# Altium project ESP32-HomeHub.PrjPcb
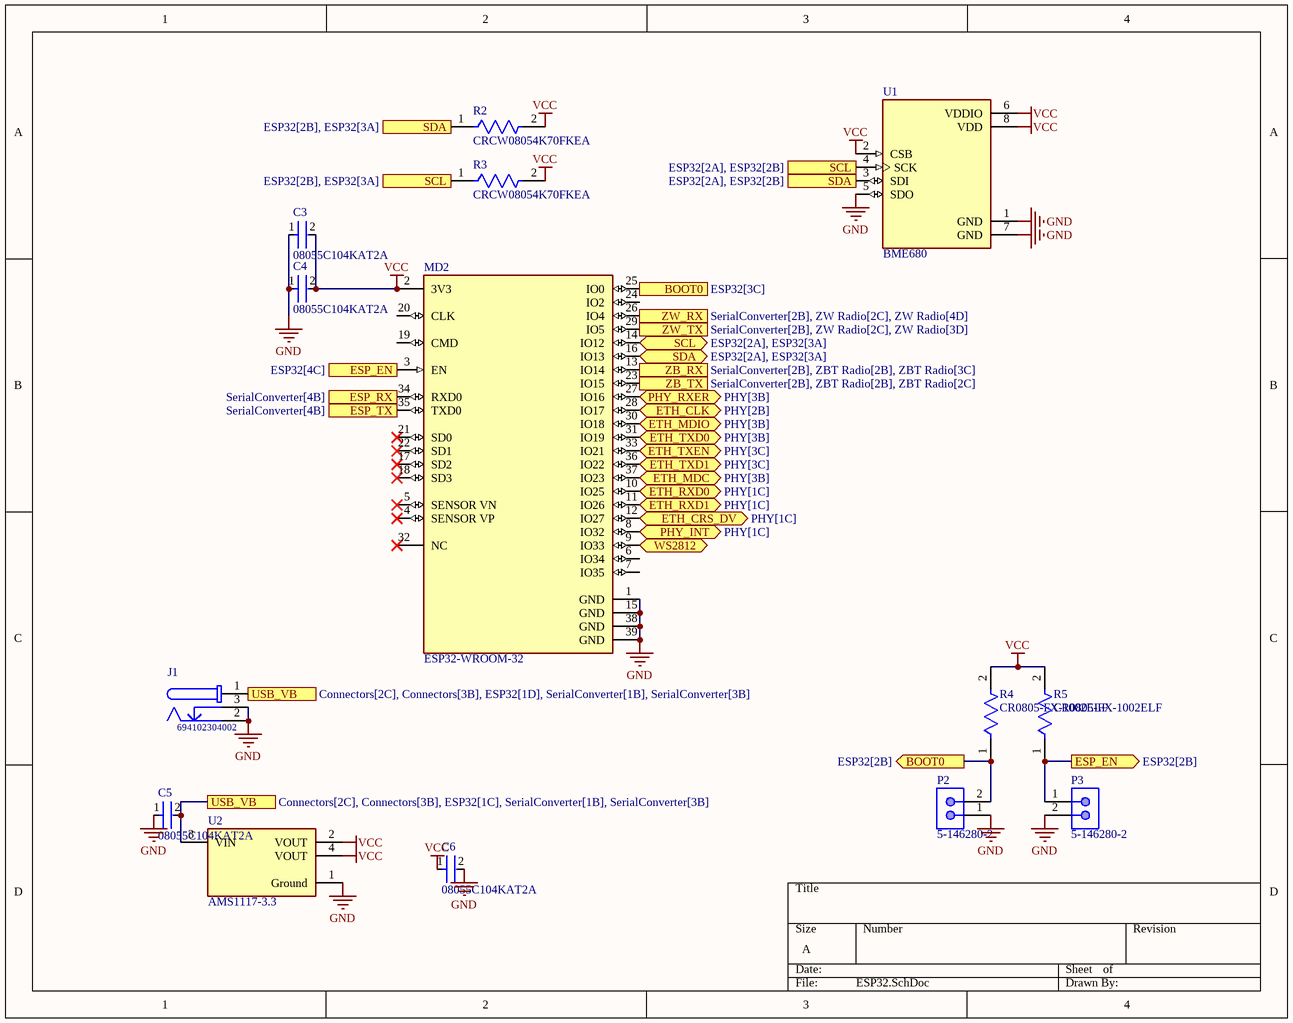
[diagram p0: ESP32.SchDoc]
5 sheets, 46 parts. Net scope: flat (ports and power ports of the same name join across sheets).
Board file: PCB1.PcbDoc
Sheets:
  ESP32.SchDoc
  SerialConverter.SchDoc
  Connectors.SchDoc
  PHY.SchDoc
  ZW Radio.SchDoc

## Sheet ESP32.SchDoc
size A; SheetNumber: 2; SheetTotal: 6

### Parts
C3  08055C104KAT2A  [FP-0805-L_2_01_0_2-W_1_25-IPC_C]
C4  08055C104KAT2A  [FP-0805-L_2_01_0_2-W_1_25-IPC_C]
C5  08055C104KAT2A  [FP-0805-L_2_01_0_2-W_1_25-IPC_C]
C6  08055C104KAT2A  [FP-0805-L_2_01_0_2-W_1_25-IPC_C]
J1  694102304002  [694102304002]
MD2  ESP32-WROOM-32  [FP-ESP32-WROOM-32-MFG]
P2  5-146280-2  [TECO-5-146280-2_V]
P3  5-146280-2  [TECO-5-146280-2_V]
R2  CRCW08054K70FKEA  [FP-CRCW0805-e3-IPC_B]
R3  CRCW08054K70FKEA  [FP-CRCW0805-e3-IPC_B]
R4  CR0805-FX-1002ELF  [FP-CR0805-IPC_A]
R5  CR0805-FX-1002ELF  [FP-CR0805-IPC_A]
U1  BME680  [PSON80P300X300X100-8N]
U2  AMS1117-3.3  [FP-AMS1117-IPC_C]

### Ports
BOOT0 (in, see ESP32[3C]), BOOT0 (out, see ESP32[2B]), ESP_EN (in, see ESP32[4C]), ESP_EN (out, see ESP32[2B]), ESP_RX (in, see SerialConverter[4B]), ESP_TX (out, see SerialConverter[4B]), ETH_CLK (bidir, see PHY[2B]), ETH_CRS_DV (bidir, see PHY[1C]), ETH_MDC (bidir, see PHY[3B]), ETH_MDIO (bidir, see PHY[3B]), ETH_RXD0 (bidir, see PHY[1C]), ETH_RXD1 (bidir, see PHY[1C]), ETH_TXD0 (bidir, see PHY[3B]), ETH_TXD1 (bidir, see PHY[3C]), ETH_TXEN (bidir, see PHY[3C]), PHY_INT (bidir, see PHY[1C]), PHY_RXER (bidir, see PHY[3B]), SCL (bidir, see ESP32[2A], ESP32[3A]), SCL (see ESP32[2A], ESP32[2B]), SCL (see ESP32[2B], ESP32[3A]), SDA (bidir, see ESP32[2A], ESP32[3A]), SDA (see ESP32[2A], ESP32[2B]), SDA (see ESP32[2B], ESP32[3A]), USB_VB (see Connectors[2C], Connectors[3B], ESP32[1C], SerialConverter[1B], SerialConverter[3B]), USB_VB (see Connectors[2C], Connectors[3B], ESP32[1D], SerialConverter[1B], SerialConverter[3B]), WS2812 (bidir), ZB_RX (out, see SerialConverter[2B], ZBT Radio[2B], ZBT Radio[3C]), ZB_TX (in, see SerialConverter[2B], ZBT Radio[2B], ZBT Radio[2C]), ZW_RX (out, see SerialConverter[2B], ZW Radio[2C], ZW Radio[4D]), ZW_TX (in, see SerialConverter[2B], ZW Radio[2C], ZW Radio[3D])

### Nets
GND: C3.1 C4.1 C5.1 C6.2 J1.2 J1.3 MD2.1(GND) MD2.15(GND) MD2.38(GND) MD2.39(GND) P2.1 P3.2 U1.1(GND) U1.5(SDO) U1.7(GND) U2.1(Ground)
VCC: C3.2 C4.2 C6.1 MD2.2(3V3) R2.2 R3.2 R4.2 R5.2 U1.2(CSB) U1.6(VDDIO) U1.8(VDD) U2.2(VOUT) U2.4(VOUT)
BOOT0: MD2.25(IO0) P2.2 R4.1 ; port BOOT0
ESP_EN: MD2.3(EN) P3.1 R5.1 ; port ESP_EN
ESP_RX: MD2.34(RXD0) ; port ESP_RX
ESP_TX: MD2.35(TXD0) ; port ESP_TX
ETH_CLK: MD2.28(IO17) ; port ETH_CLK
ETH_CRS_DV: MD2.12(IO27) ; port ETH_CRS_DV
ETH_MDC: MD2.37(IO23) ; port ETH_MDC
ETH_MDIO: MD2.30(IO18) ; port ETH_MDIO
ETH_RXD0: MD2.10(IO25) ; port ETH_RXD0
ETH_RXD1: MD2.11(IO26) ; port ETH_RXD1
ETH_TXD0: MD2.31(IO19) ; port ETH_TXD0
ETH_TXD1: MD2.36(IO22) ; port ETH_TXD1
ETH_TXEN: MD2.33(IO21) ; port ETH_TXEN
PHY_INT: MD2.8(IO32) ; port PHY_INT
PHY_RXER: MD2.27(IO16) ; port PHY_RXER
SCL: MD2.14(IO12) R3.1 U1.4(SCK) ; port SCL
SDA: MD2.16(IO13) R2.1 U1.3(SDI) ; port SDA
USB_VB: C5.2 J1.1 U2.3(VIN) ; port USB_VB
WS2812: MD2.9(IO33) ; port WS2812
ZB_RX: MD2.13(IO14) ; port ZB_RX
ZB_TX: MD2.23(IO15) ; port ZB_TX
ZW_RX: MD2.26(IO4) ; port ZW_RX
ZW_TX: MD2.29(IO5) ; port ZW_TX

Not connected (* = marked no-connect by the designer): MD2 4(SENSOR_VP)* 5(SENSOR_VN)* 6(IO34) 7(IO35) 17(SD2)* 18(SD3)* 19(CMD) 20(CLK) 21(SD0)* 22(SD1)* 24(IO2) 32(NC)*

### Library data of the parts
C3-C6 = CMP-2000-05016-2: General Purpose Ceramic Capacitor, 0805, 100nF, 10%, X7R, 0.15, 50V; Dissipation Factor: 2.5%; Insulation Resistance: 100GR; Voltage Rating (DC): 50V; Package Quantity: 4000; Tolerance: 10%; Voltage Rating: 50V; Dielectric: X7R; Case/Package: 0805; Lead Free: Lead Free; Dielectric Material: Ceramic; Thickness: 0.037inch; Weight: 0.001411oz; Max Operating Temperature: 125°C; REACH SVHC: No SVHC; Mount: Surface Mount; RoHS Compliant: Yes; Depth: 1.25mm; Height: 0.5mm; Case Code (Metric): 2012; Length: 2mm; Termination: Standard; Case Code (Imperial): 0805; Number of Pins: 2; Voltage: 50V; Radiation Hardening: No; Min Operating Temperature: -55°C; Capacitance: 100nF; Width: 1.2mm; Series: MLCC X7R; Packaging: Cut Tape
J1 = CMP-1502-00184-1: DC Power Jack Connector Low Profile WR-DC, Male, Right Angled, THT, 2 A, 20 V; Manufacturer: Wurth Elektronik; Plug Outer Diameter: 3.5mm; Opening Diameter: 3.8mm; Plug Inner Diameter: 1.05mm; Rated Current: 2A; Working Voltage: 20V; Datasheet URL: http://katalog.we-online.de/em/datasheet/6941xx304002.pdf; Manufacturer URL: http://www.we-online.de; Publisher: WurthElektronik; Part Number: 694102304002; Package Reference: 694102304002; Packaging: Tray; Mounting Technology: THT; Operating Temperature: -40to85degC; Orientation: RightAngled; Gender: Male
MD2 = CMP-194065-000008-1: RX TXRX MOD WIFI SURFACE MOUNT; Frequency: 2.5GHz; Sensitivity: -98dBm; Operating Supply Voltage: 3.6V; Data Rate: 150Mbps; Weight: 0.088185oz; Package Quantity: 550; Min Operating Temperature: -40°C; Mount: Surface Mount; Max Operating Temperature: 85°C; Packaging: Cut Tape; Case/Package: SMD/SMT
P2 P3 = CMP-2000-07492-1: Male Header, Pitch 2.54 mm, 1 x 2 Position, Height 8.21 mm, Tail Length 3.05 mm, -65 to 105 degC, RoHS, Bulk; Manufacturer: TE Connectivity; Mating Connector Lock: No(Without); Number of Positions: 2; Pitch: 2.54mm; PCB Mounting Orientation: Vertical; Keyed: No; Case\/Package: 100; Mating Post Length: 0.23inch; High Temperature Housing: Yes; Max Current Rating: 5A; PCB Thickness: 0.063inch; PCB Mount Retention: Without; Approvals: CSA; Current Rating: 3A; Radiation Hardening: No; Length: 4.67mm; Contact Mating Length: 0.23inch; Connector Type: Header; Number of Rows: 1; Termination Post Length: 0.12inch; Board Standoff: No(Without); Max Operating Temperature: 105degC; Contact Shape: Square; Selectively Loaded: No(Without); Gasket: No(Without); Number of Contacts: 2; Contact Gender: Male; Mating Alignment: No(Without); Manufacturer URL: http://www.te.com/; Datasheet URL: http://www.te.com/commerce/DocumentDelivery/DDEController?Action=showdoc&DocId=Customer+Drawing%7F146280%7FH1%7Fpdf%7FEnglish%7FENG_CD_146280_H1.pdf%7F5-146280-2; Mount: ThroughHole; Orientation: Straight; Packaging: Carton; Package Reference: 5-146280-2; Package Quantity: 500; Stabilizers: No(Without); Row Spacing: 2.54mm; Contact Material: CopperAlloy; Panel Mount Retention: No(Without); Datasheet Version: Rev. H1, 08/2016; Housing Colour: Black; Colour: Black; Package Description: Male Header, Pitch 2.54 mm, 1 x 2 Position, Height 8.21 mm, Tail Length 3.05 mm; Contact Plating: Matte; Housing Material: Polymer; Contact Protection: No(Without); Min Operating Temperature: -65degC; Mounting Technology: ThroughHole; Flammability Rating: UL94V-0; RoHSCompliant: true; Termination: ThroughHole; Depth: 2.34mm; High Speed Serial Data Connector: No
R2 R3 = CMP-2100-03615-2: RES Thick Film, 4.7kΩ, 1%, 0.125W, 100ppm/°C, 0805; Max Power Dissipation: 125mW; Resistance: 4.7kR; Voltage Rating: 150V; Termination: SMD/SMT; Weight: 0.000194oz; Case/Package: 0805; Number of Terminations: 2; Min Operating Temperature: -55°C; Case Code (Metric): 2012; Package Quantity: 10; Depth: 1.25mm; Military Standard: Not; Composition: Thick Film; Radiation Hardening: No; Contact Plating: Tin; Height: 0.45mm; Power Rating: 125mW; Features: Automotive AEC-Q200; Tolerance: 1%; Packaging: Tape and Reel; Max Operating Temperature: 155°C; Length: 2mm; Case Code (Imperial): 0805; Voltage Rating (DC): 150V; Width: 1.25mm; Temperature Coefficient: 100ppm/°C; Lead Free: Lead Free
R4 R5 = CMP-07231-003204-1: Thick Film Chip Resistors 0805 10kΩ 0.125W 1% 100ppm/°C; Max Power Dissipation: 125mW; Voltage Rating: 150V; Voltage Rating (DC): 100V; Resistance: 10kR; Height: 0.5mm; Tolerance: 1%; Max Operating Temperature: 155°C; Thickness: 508um; Radiation Hardening: No; Packaging: Tape and Reel; Depth: 1.25mm; Contact Plating: Tin; Package Quantity: 1; Case Code (Metric): 2012; REACH SVHC: No SVHC; Min Operating Temperature: -55°C; Power Rating: 125mW; Mount: Surface Mount; Length: 2mm; Case Code (Imperial): 0805; Width: 1.25mm; Temperature Coefficient: 100ppm/°C; Termination: SMD/SMT; Composition: Thick Film; Features: Moisture Resistant; Case/Package: 0805; Number of Terminations: 2
U1 = BME680: Integrated Environmental Unit; MF: {'manufacturer': u'Bosch Sensortec'}; Package: None; Price: None; Value: *; MP: BME680; Availability: Unavailable
U2 = CMP-209535-000001-1: LDO Voltage Regulators 1A, 3.3V; Manufacturer: Advanced Monolithic Systems; Dropout Voltage: 1.1V; Output Type: Fixed; Nominal Supply Current: 5mA; Max Power Dissipation: 1.2W; Max Supply Voltage: 15V; Number Of Outputs: 1; Standoff Height: 0.64mm; Max Junction Temp: +125°C; Height: 1.8mm; Package: AMS1117; Device Class L2: Power Management ICs; ComponentLink2Description: Datasheet; ComponentLink2URL: http://www.advanced-monolithic.com/pdf/ds1117.pdf; Category: IC; RoHS: TRUE; Automotive: No; Device Class L1: Integrated Circuits (ICs); Output Current: 1A; Device Class L3: Voltage Regulators - Linear; Temperature: -40°C to +125°C; Output Voltage: 3.3V; Manufacturer Part Number: AMS1117-3.3; Temperature Range Low: -40°C; Octopart: https://octopart.com/ams1117-3.3-advanced+monolithic+systems-25899300; Lead Free: Yes; Ipc Land Pattern Name: SOT229P700X180-4; Temperature Range High: +125°C

## Sheet SerialConverter.SchDoc
size A; SheetNumber: 3; SheetTotal: 6
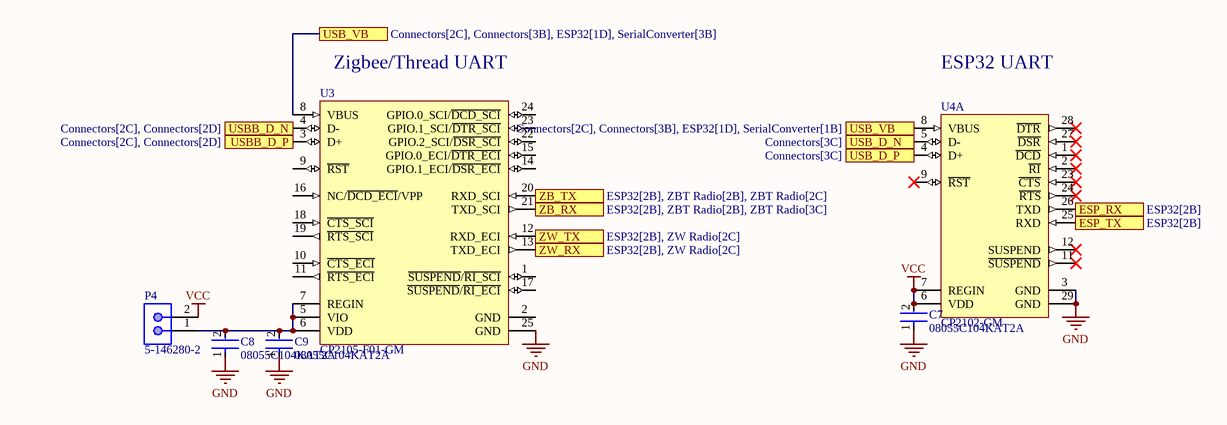
[diagram p1: SerialConverter.SchDoc]

### Parts
C7  08055C104KAT2A  [FP-0805-L_2_01_0_2-W_1_25-IPC_C]
C8  08055C104KAT2A  [FP-0805-L_2_01_0_2-W_1_25-IPC_C]
C9  08055C104KAT2A  [FP-0805-L_2_01_0_2-W_1_25-IPC_C]
P4  5-146280-2  [TECO-5-146280-2_V]
U3  CP2105-F01-GM  [SLAB-QFN-24-2675x2675TP_N]
U4  CP2102-GM  [SLAB-QFN-28-3125x3125TP_N]  (part A of 2)

### Ports
ESP_RX (out, see ESP32[2B]), ESP_TX (in, see ESP32[2B]), USB_D_N (see Connectors[3C]), USB_D_P (see Connectors[3C]), USB_VB (see Connectors[2C], Connectors[3B], ESP32[1D], SerialConverter[1B]), USB_VB (see Connectors[2C], Connectors[3B], ESP32[1D], SerialConverter[3B]), USBB_D_N (see Connectors[2C], Connectors[2D]), USBB_D_P (see Connectors[2C], Connectors[2D]), ZB_RX (out, see ESP32[2B], ZBT Radio[2B], ZBT Radio[3C]), ZB_TX (in, see ESP32[2B], ZBT Radio[2B], ZBT Radio[2C]), ZW_RX (out, see ESP32[2B], ZW Radio[2C]), ZW_TX (in, see ESP32[2B], ZW Radio[2C])

### Nets
GND: C7.1 C8.1 C9.1 U3.25(GND) U4.3(GND) U4.29(GND)
VCC: C7.2 P4.2 U4.6(VDD) U4.7(REGIN)
ESP_RX: U4.26(TXD) ; port ESP_RX
ESP_TX: U4.25(RXD) ; port ESP_TX
USB_D_N: U4.5(D-) ; port USB_D_N
USB_D_P: U4.4(D+) ; port USB_D_P
USB_VB: U3.8(VBUS) U4.8(VBUS) ; port USB_VB
USBB_D_N: U3.4(D-) ; port USBB_D_N
USBB_D_P: U3.3(D+) ; port USBB_D_P
ZB_RX: U3.21(TXD_SCI) ; port ZB_RX
ZB_TX: U3.20(RXD_SCI) ; port ZB_TX
ZW_RX: U3.13(TXD_ECI) ; port ZW_RX
ZW_TX: U3.12(RXD_ECI) ; port ZW_TX
NetC8_2: C8.2 C9.2 P4.1 U3.5(VIO) U3.6(VDD) U3.7(REGIN)

Not connected (* = marked no-connect by the designer): U3 1(~{SUSPEND}/~{RI_SCI}) 2(GND) 9(~{RST}) 10(~{CTS_ECI}) 11(~{RTS_ECI}) 14(GPIO.1_ECI/~{DSR_ECI}) 15(GPIO.0_ECI/~{DTR_ECI}) 16(NC/~{DCD_ECI}/VPP) 17(~{SUSPEND}/~{RI_ECI}) 18(~{CTS_SCI}) 19(~{RTS_SCI}) 22(GPIO.2_SCI/~{DSR_SCI}) 23(GPIO.1_SCI/~{DTR_SCI}) 24(GPIO.0_SCI/~{DCD_SCI}); U4 1(~{DCD})* 2(~{RI})* 9(~{RST})* 11(~{SUSPEND})* 12(SUSPEND)* 23(~{CTS})* 24(~{RTS})* 27(~{DSR})* 28(~{DTR})*

### Notes on the sheet
- (near U3) Zigbee/Thread UART
- ESP32 UART

### Library data of the parts
C7-C9 = CMP-2000-05016-2: as C3 on sheet ESP32; Voltage Rating (DC): 50V; Package Quantity: 4000; Tolerance: 10%; Voltage Rating: 50V; Dielectric: X7R; Case/Package: 0805; Lead Free: Lead Free; Dielectric Material: Ceramic; Thickness: 0.037inch; Weight: 0.001411oz; Max Operating Temperature: 125°C; REACH SVHC: No SVHC; Mount: Surface Mount; RoHS Compliant: Yes; Depth: 1.25mm; Height: 0.5mm; Case Code (Metric): 2012; Length: 2mm; Termination: Standard; Case Code (Imperial): 0805; Number of Pins: 2; Voltage: 50V; Radiation Hardening: No; Min Operating Temperature: -55°C; Capacitance: 100nF; Width: 1.2mm; Series: MLCC X7R; Packaging: Cut Tape
P4 = CMP-2000-07492-1: as P2 on sheet ESP32; Radiation Hardening: No; Length: 4.67mm; Contact Mating Length: 0.23inch; Connector Type: Header; Number of Rows: 1; Termination Post Length: 0.12inch; Board Standoff: No(Without); Max Operating Temperature: 105degC; Contact Shape: Square; Selectively Loaded: No(Without); Gasket: No(Without); Number of Contacts: 2; Contact Gender: Male; Mating Alignment: No(Without); Manufacturer URL: http://www.te.com/; Datasheet URL: http://www.te.com/commerce/DocumentDelivery/DDEController?Action=showdoc&DocId=Customer+Drawing%7F146280%7FH1%7Fpdf%7FEnglish%7FENG_CD_146280_H1.pdf%7F5-146280-2; Mount: ThroughHole; Orientation: Straight; Packaging: Carton; Package Reference: 5-146280-2; Package Quantity: 500; Stabilizers: No(Without); Row Spacing: 2.54mm; Contact Material: CopperAlloy; Panel Mount Retention: No(Without); Datasheet Version: Rev. H1, 08/2016; Housing Colour: Black; Colour: Black; Package Description: Male Header, Pitch 2.54 mm, 1 x 2 Position, Height 8.21 mm, Tail Length 3.05 mm; Contact Plating: Matte; Housing Material: Polymer; Contact Protection: No(Without); Min Operating Temperature: -65degC; Mounting Technology: ThroughHole; Flammability Rating: UL94V-0; RoHSCompliant: true; Termination: ThroughHole; Depth: 2.34mm; High Speed Serial Data Connector: No
U3 = CMP-0511-00003-1: Single-Chip USB to Dual UART Bridge, 5 Dig I/O Pins, Internal Oscillator, 296 Bytes EEPROM, -40 to 85 degC, 24-pin QFN; Manufacturer: Silicon Labs; Internal Oscillator: TRUE; Sub-Family: USB Bridges; ComponentLink3URL: http://www.silabs.com/Support%20Documents/TechnicalDocs/C8051F93x-92x.pdf; PartNumber: CP2105-F01-GM; PackageDescription: 24-Pin Quad-Flat No-Leads Package, Body 4 x 4 mm, Pitch 0.5 mm; Code_JEDEC: MO-220; ComponentLink2URL: http://www.silabs.com/Support%20Documents/TechnicalDocs/CP2105.pdf; Mounting Technology: Surface Mount; ComponentLink1URL: http://www.silabs.com/; ComponentLink1Description: Manufacturer URL; EEPROM: 296 Bytes; ComponentLink2Description: Datasheet; ComponentLink3Description: Package Specification; Code_IPC: J-STD-020; DatasheetVersion: Rev. 1.0; PackageReference: QFN-24
U4 = CMP-0511-00012-1: Single-Chip USB to UART Bridge, 1024 Bytes EEPROM, -40 to 85 degC, 28-pin QFN, Tube; Manufacturer: Silicon Labs; Internal Oscillator: TRUE; Sub-Family: USB Bridges; ComponentLink3Description: Package Specification; PackageDescription: 28-Pin Quad-Flat No-Leads Package, Body 5 x 5 mm, Pitch 0.5 mm; PartNumber: CP2102-GM; EEPROM: 1024 Bytes; Mounting Technology: Surface Mount; ComponentLink2URL: http://www.silabs.com/Support%20Documents/TechnicalDocs/CP2102-9.pdf; DatasheetVersion: Rev. 1.5; ComponentLink1URL: http://www.silabs.com/; ComponentLink2Description: Datasheet; Code_JEDEC: MO-220; PackageReference: QFN-28; Code_IPC: J-STD-020C; ComponentLink3URL: http://www.silabs.com/Support%20Documents/TechnicalDocs/C8051T61x.pdf; ComponentLink1Description: Manufacturer URL

## Sheet Connectors.SchDoc
size A; SheetNumber: 4; SheetTotal: 6
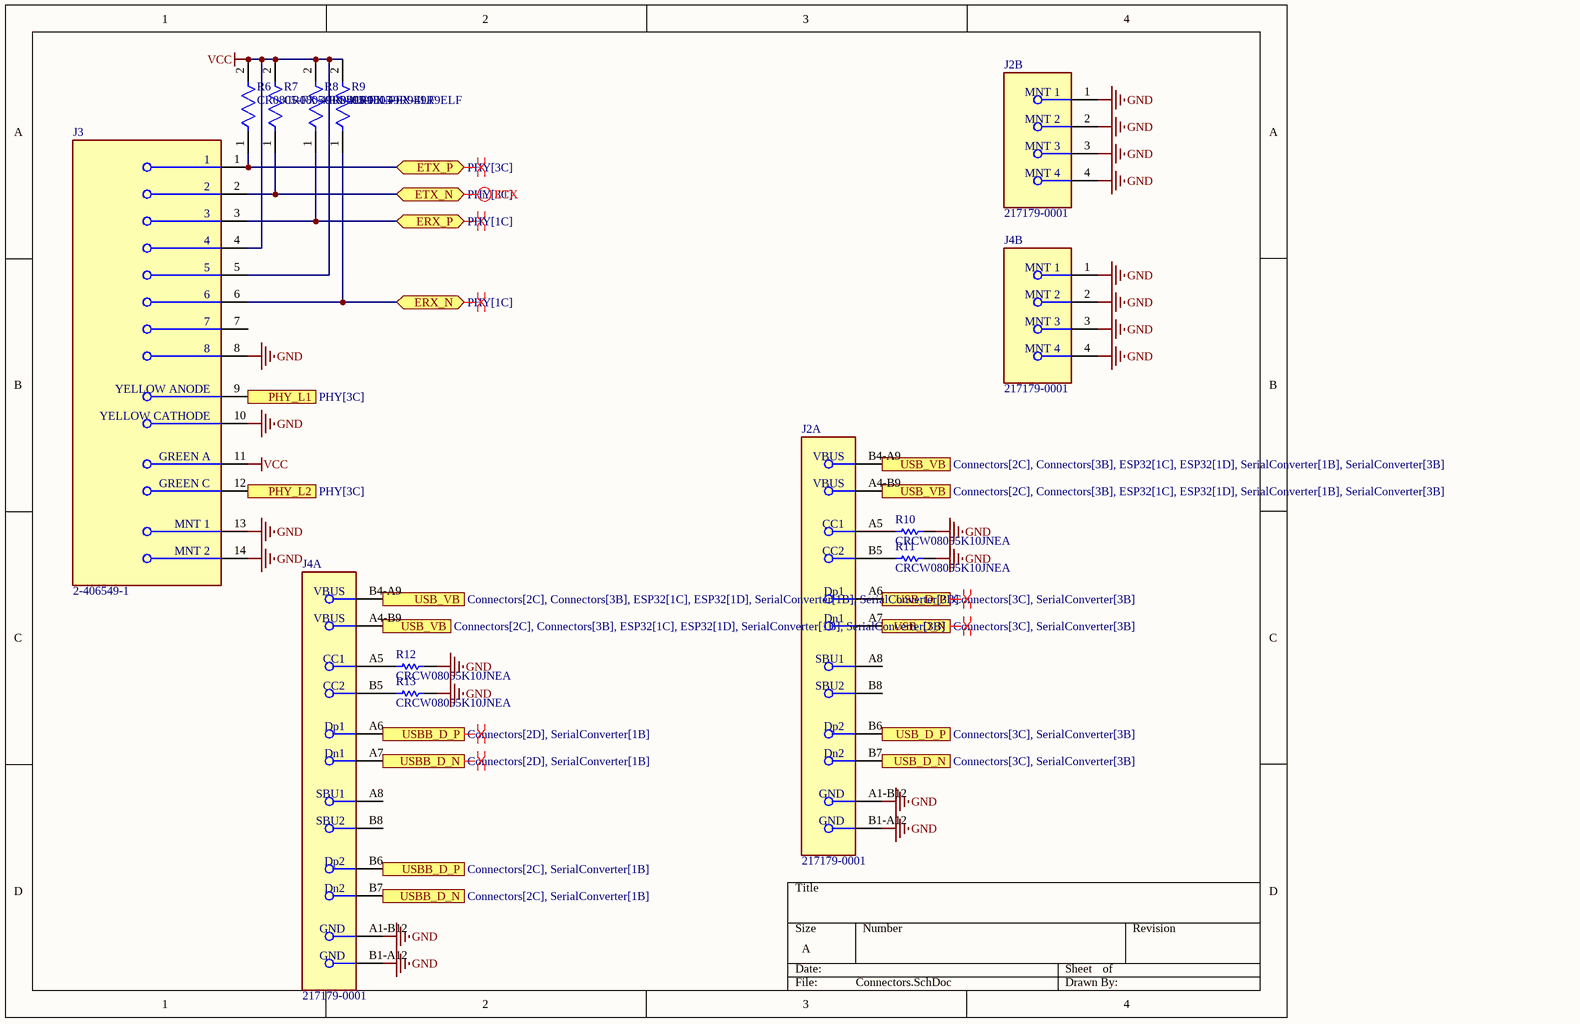
[diagram p2: Connectors.SchDoc]

### Parts
J2  217179-0001  [FP-217179-0001-MFG]  (parts A,B of 2)
J3  2-406549-1  [FP-2-406549-1-MFG]
J4  217179-0001  [FP-217179-0001-MFG]  (parts A,B of 2)
R6  CR0805-FX-49R9ELF  [FP-CR0805-MFG]
R7  CR0805-FX-49R9ELF  [FP-CR0805-MFG]
R8  CR0805-FX-49R9ELF  [FP-CR0805-MFG]
R9  CR0805-FX-49R9ELF  [FP-CR0805-MFG]
R10  CRCW08055K10JNEA  [RESC2013X50X30LL20T20]
R11  CRCW08055K10JNEA  [RESC2013X50X30LL20T20]
R12  CRCW08055K10JNEA  [RESC2013X50X30LL20T20]
R13  CRCW08055K10JNEA  [RESC2013X50X30LL20T20]

### Ports
ERX_N (bidir, see PHY[1C]), ERX_P (bidir, see PHY[1C]), ETX_N (bidir, see PHY[3C]), ETX_P (bidir, see PHY[3C]), PHY_L1 (in, see PHY[3C]), PHY_L2 (out, see PHY[3C]), USB_D_N (see Connectors[3C], SerialConverter[3B]), USB_D_P (see Connectors[3C], SerialConverter[3B]), USB_VB (see Connectors[2C], Connectors[3B], ESP32[1C], ESP32[1D], SerialConverter[1B], SerialConverter[3B]), USBB_D_N (see Connectors[2C], SerialConverter[1B]), USBB_D_N (see Connectors[2D], SerialConverter[1B]), USBB_D_P (see Connectors[2C], SerialConverter[1B]), USBB_D_P (see Connectors[2D], SerialConverter[1B])

### Nets
GND: J2.1(MNT_1) J2.2(MNT_2) J2.3(MNT_3) J2.4(MNT_4) J2.A1-B12(GND) J2.B1-A12(GND) J3.8 J3.10(YELLOW_CATHODE) J3.13(MNT_1) J3.14(MNT_2) J4.1(MNT_1) J4.2(MNT_2) J4.3(MNT_3) J4.4(MNT_4) J4.A1-B12(GND) J4.B1-A12(GND) R10.2 R11.2 R12.2 R13.2
VCC: J3.4 J3.5 J3.11(GREEN_A) R6.2 R7.2 R8.2 R9.2
ERX_N: J3.6 R9.1 ; port ERX_N
ERX_P: J3.3 R8.1 ; port ERX_P
ETX_N: J3.2 R7.1 ; port ETX_N
ETX_P: J3.1 R6.1 ; port ETX_P
PHY_L1: J3.9(YELLOW_ANODE) ; port PHY_L1
PHY_L2: J3.12(GREEN_C) ; port PHY_L2
USB_D_N: J2.A7(Dn1) J2.B7(Dn2) ; port USB_D_N
USB_D_P: J2.A6(Dp1) J2.B6(Dp2) ; port USB_D_P
USB_VB: J2.A4-B9(VBUS) J2.B4-A9(VBUS) J4.A4-B9(VBUS) J4.B4-A9(VBUS) ; port USB_VB
USBB_D_N: J4.A7(Dn1) J4.B7(Dn2) ; port USBB_D_N
USBB_D_P: J4.A6(Dp1) J4.B6(Dp2) ; port USBB_D_P
NetJ2_A5: J2.A5(CC1) R10.1
NetJ2_B5: J2.B5(CC2) R11.1
NetJ4_A5: J4.A5(CC1) R12.1
NetJ4_B5: J4.B5(CC2) R13.1

Not connected (* = marked no-connect by the designer): J2 A8(SBU1) B8(SBU2); J3 7; J4 A8(SBU1) B8(SBU2)

### Layout directives
differential pair: ERX_N, ERX_P, ETX_N, ETX_P, USB_D_N, USB_D_P, USBB_D_N, USBB_D_P

### Library data of the parts
J2 J4 = CMP-04767-000028-1: CONN RCP USB2.0 TYP C 24P SMD RA
J3 = CMP-2000-05541-2: CONN MOD JACK 8P8C R/A SHIELDED; Max Voltage Rating (AC): 150V; Number of Contacts: 8; PCB Mounting Orientation: Right Angle; Direction: Up; Pitch: 2.03mm; Number of Ports: 1; Gender: Female; Tail Length: 2.54mm; Current Rating: 1.5A; Keyed: No; Approvals: UL; PCB Thickness: 1.57mm; Element Configuration: Single; Connector Type: Jack; Color: Yellow; Max Operating Temperature: 85°C; Weight: 0.144729oz; Series: -; Orientation: Right Angle; Width: 17.27mm; Package Quantity: 63; Mount: Panel; Contact Plating: Gold; Length: 17.86mm; Depth: 15.75mm; Flammability Rating: UL94 V-0; Shielding: Shielded; Housing Material: Thermoplastic; Number of Positions Loaded: 8; Contact Material: Bronze; Voltage Rating: 150V; Packaging: Tray; Number of Positions: 8; Termination: Solder; Number of Rows: 1; Radiation Hardening: No; Min Operating Temperature: -40°C; RoHS Compliant: Yes; Housing Color: Black
R6-R9 = CMP-07231-001472-1: Thick Film Chip Resistors 0805 49.9Ω 0.125W 1% 100ppm/°C; Voltage Rating (DC): 150V; Power Rating: 125mW; Resistance: 49.9R; Contact Plating: Tin; Radiation Hardening: No; Height: 0.5mm; Tolerance: 1%; Temperature Coefficient: 100ppm/°C; Min Operating Temperature: -55°C; Thickness: 508um; Termination: SMD/SMT; Depth: 1.25mm; Length: 2mm; Number of Pins: 2; Military Standard: Not; Case Code (Metric): 2012; Package Quantity: 5000; Width: 1.25mm; Mount: Surface Mount; Case Code (Imperial): 0805; Max Operating Temperature: 155°C; Voltage Rating: 150V; Composition: Thick Film; Case/Package: 0805; Packaging: Tape and Reel; REACH SVHC: No SVHC
R10-R13 = CMP-2001-04025-1: Manufacturer: Vishay Dale; Part Number: CRCW08055K10JNEA

## Sheet PHY.SchDoc
size A; SheetNumber: 5; SheetTotal: 6
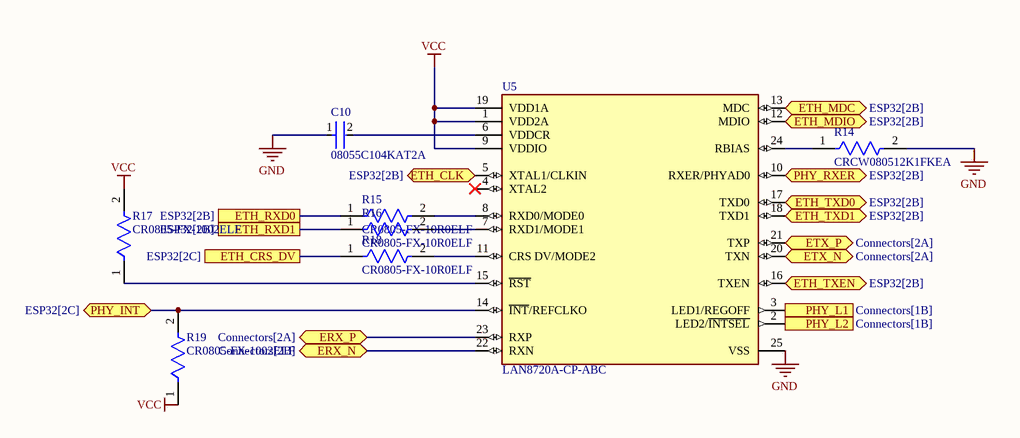
[diagram p3: PHY.SchDoc]

### Parts
C10  08055C104KAT2A  [FP-0805-L_2_01_0_2-W_1_25-IPC_C]
R14  CRCW080512K1FKEA  [FP-CRCW0805-e3-IPC_B]
R15  CR0805-FX-10R0ELF  [FP-CR0805-IPC_B]
R16  CR0805-FX-10R0ELF  [FP-CR0805-IPC_B]
R17  CR0805-FX-1002ELF  [FP-CR0805-IPC_A]
R18  CR0805-FX-10R0ELF  [FP-CR0805-IPC_B]
R19  CR0805-FX-1002ELF  [FP-CR0805-IPC_A]
U5  LAN8720A-CP-ABC  [FP-24-S4QFN-4x4B-0_5P-IPC_B]

### Ports
ERX_N (bidir, see Connectors[2B]), ERX_P (bidir, see Connectors[2A]), ETH_CLK (bidir, see ESP32[2B]), ETH_CRS_DV (see ESP32[2C]), ETH_MDC (bidir, see ESP32[2B]), ETH_MDIO (bidir, see ESP32[2B]), ETH_RXD0 (see ESP32[2B]), ETH_RXD1 (see ESP32[2B]), ETH_TXD0 (bidir, see ESP32[2B]), ETH_TXD1 (bidir, see ESP32[2B]), ETH_TXEN (bidir, see ESP32[2B]), ETX_N (bidir, see Connectors[2A]), ETX_P (bidir, see Connectors[2A]), PHY_INT (bidir, see ESP32[2C]), PHY_L1 (out, see Connectors[1B]), PHY_L2 (out, see Connectors[1B]), PHY_RXER (bidir, see ESP32[2B])

### Nets
GND: C10.1 R14.2 U5.25(VSS)
VCC: R17.2 R19.1 U5.1(VDD2A) U5.9(VDDIO) U5.19(VDD1A)
ERX_N: U5.22(RXN) ; port ERX_N
ERX_P: U5.23(RXP) ; port ERX_P
ETH_CLK: U5.5(XTAL1/CLKIN) ; port ETH_CLK
ETH_CRS_DV: R18.1 ; port ETH_CRS_DV
ETH_MDC: U5.13(MDC) ; port ETH_MDC
ETH_MDIO: U5.12(MDIO) ; port ETH_MDIO
ETH_RXD0: R15.1 ; port ETH_RXD0
ETH_RXD1: R16.1 ; port ETH_RXD1
ETH_TXD0: U5.17(TXD0) ; port ETH_TXD0
ETH_TXD1: U5.18(TXD1) ; port ETH_TXD1
ETH_TXEN: U5.16(TXEN) ; port ETH_TXEN
ETX_N: U5.20(TXN) ; port ETX_N
ETX_P: U5.21(TXP) ; port ETX_P
PHY_INT: R19.2 U5.14(~{INT}/REFCLKO) ; port PHY_INT
PHY_L1: U5.3(LED1/REGOFF) ; port PHY_L1
PHY_L2: U5.2(LED2/~{INTSEL}) ; port PHY_L2
PHY_RXER: U5.10(RXER/PHYAD0) ; port PHY_RXER
NetC10_2: C10.2 U5.6(VDDCR)
NetR14_1: R14.1 U5.24(RBIAS)
NetR15_2: R15.2 U5.8(RXD0/MODE0)
NetR16_2: R16.2 U5.7(RXD1/MODE1)
NetR17_1: R17.1 U5.15(~{RST})
NetR18_2: R18.2 U5.11(CRS_DV/MODE2)

Not connected (* = marked no-connect by the designer): U5 4(XTAL2)*

### Library data of the parts
C10 = CMP-2000-05016-2: as C3 on sheet ESP32; Voltage Rating (DC): 50V; Package Quantity: 4000; Tolerance: 10%; Voltage Rating: 50V; Dielectric: X7R; Case/Package: 0805; Lead Free: Lead Free; Dielectric Material: Ceramic; Thickness: 0.037inch; Weight: 0.001411oz; Max Operating Temperature: 125°C; REACH SVHC: No SVHC; Mount: Surface Mount; RoHS Compliant: Yes; Depth: 1.25mm; Height: 0.5mm; Case Code (Metric): 2012; Length: 2mm; Termination: Standard; Case Code (Imperial): 0805; Number of Pins: 2; Voltage: 50V; Radiation Hardening: No; Min Operating Temperature: -55°C; Capacitance: 100nF; Width: 1.2mm; Series: MLCC X7R; Packaging: Cut Tape
R14 = CMP-2001-04935-2: RES Thick Film, 12.1kΩ, 1%, 0.125W, 100ppm/°C, 0805; Max Power Dissipation: 125mW; Resistance: 12.1kR; Voltage Rating: 150V; Min Operating Temperature: -55°C; Power Rating: 125mW; Length: 2mm; Tolerance: 1%; Termination: SMD/SMT; Height: 0.45mm; Radiation Hardening: No; Case/Package: 0805; Packaging: Tape and Reel; Lead Free: Lead Free; Military Standard: Not; Max Operating Temperature: 155°C; Features: Automotive AEC-Q200; Voltage Rating (DC): 150V; Width: 0.049inch; Case Code (Imperial): 0805; Depth: 1.25mm; Temperature Coefficient: 100ppm/°C; Weight: 0.000194oz; Composition: Thick Film; Case Code (Metric): 2012; Number of Terminations: 2; Package Quantity: 10; Contact Plating: Tin
R15 R16 R18 = CMP-07231-004657-1: Thick Film Chip Resistors 0805 10Ω 0.125W 1% 100ppm/°C; Voltage Rating (DC): 150V; Resistance: 10R; Power Rating: 125mW; Tolerance: 1%; Min Operating Temperature: -55°C; Length: 2mm; Case Code (Metric): 2012; Temperature Coefficient: 100ppm/°C; Height: 0.5mm; Max Operating Temperature: 155°C; Case/Package: 0805; Width: 1.25mm; Composition: Thick Film; Contact Plating: Tin; Termination: SMD/SMT; Packaging: Tape and Reel; REACH SVHC: No SVHC; Number of Pins: 2; Package Quantity: 5000; Mount: Surface Mount; Military Standard: Not; Thickness: 508um; Case Code (Imperial): 0805; Depth: 1.25mm; Radiation Hardening: No; Voltage Rating: 150V
R17 R19 = CMP-07231-003204-1: as R4 on sheet ESP32; Height: 0.5mm; Tolerance: 1%; Max Operating Temperature: 155°C; Thickness: 508um; Radiation Hardening: No; Packaging: Tape and Reel; Depth: 1.25mm; Contact Plating: Tin; Package Quantity: 1; Case Code (Metric): 2012; REACH SVHC: No SVHC; Min Operating Temperature: -55°C; Power Rating: 125mW; Mount: Surface Mount; Length: 2mm; Case Code (Imperial): 0805; Width: 1.25mm; Temperature Coefficient: 100ppm/°C; Termination: SMD/SMT; Composition: Thick Film; Features: Moisture Resistant; Case/Package: 0805; Number of Terminations: 2
U5 = CMP-06281-000057-1: IC TRANSCEIVER FULL 2/2 24SQFN

## Sheet ZW Radio.SchDoc
size A; SheetNumber: 6; SheetTotal: 6
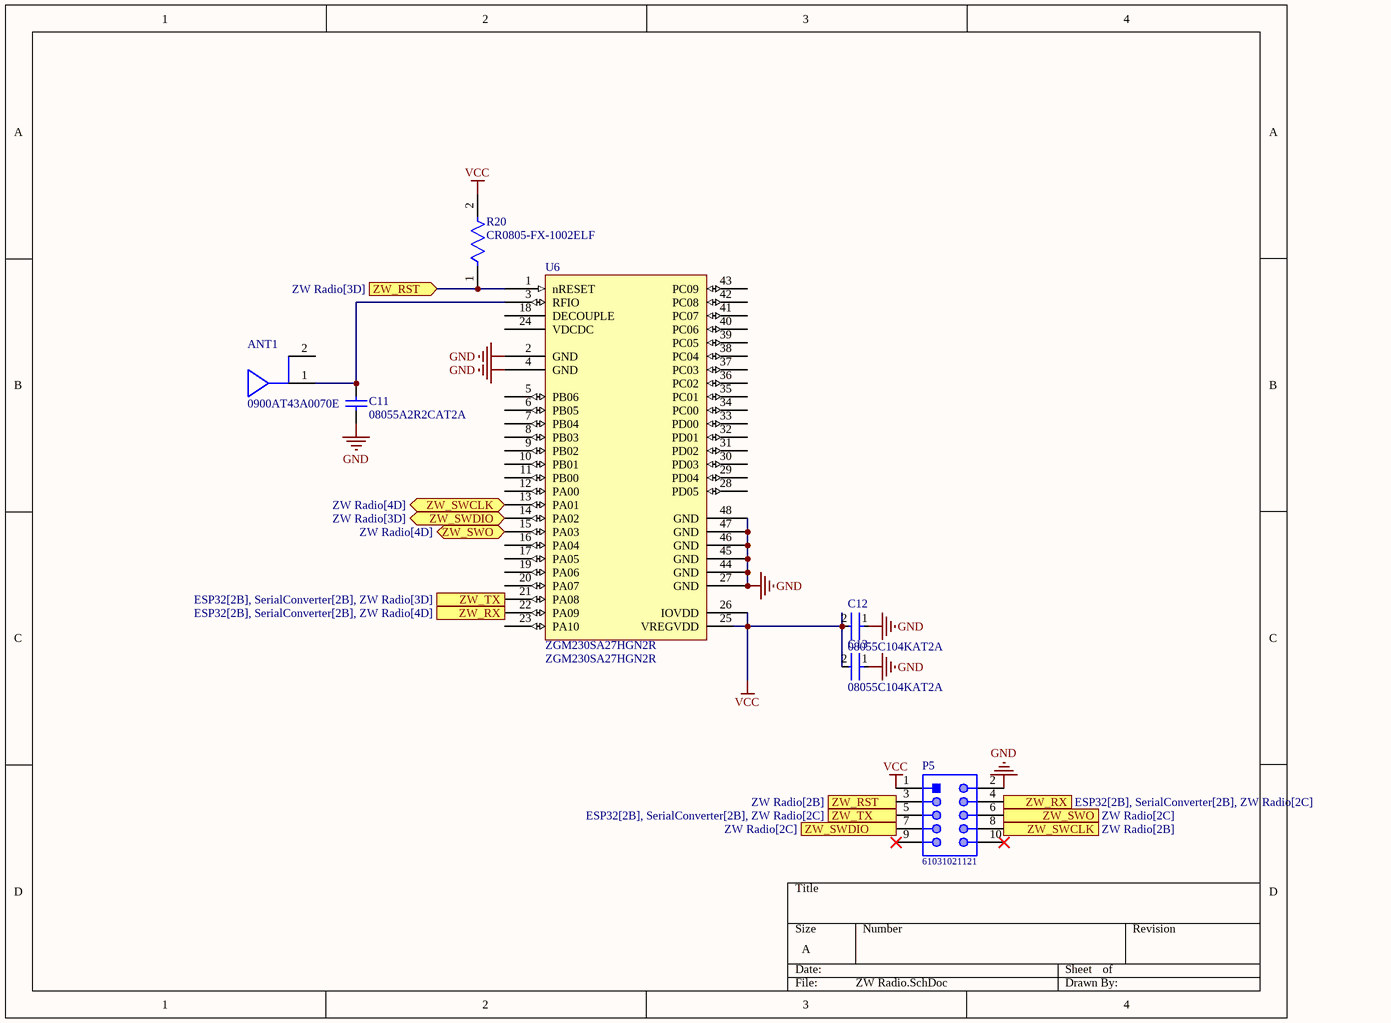
[diagram p4: ZW Radio.SchDoc]

### Parts
ANT1  0900AT43A0070E  [FP-0900AT43A0070E-MFG]
C11  08055A2R2CAT2A  [CAPC2013X94X50NL20T25]
C12  08055C104KAT2A  [FP-0805-L_2_01_0_2-W_1_25-IPC_C]
C13  08055C104KAT2A  [FP-0805-L_2_01_0_2-W_1_25-IPC_C]
P5  61031021121  [61031021121]
R20  CR0805-FX-1002ELF  [FP-CR0805-IPC_A]
U6  ZGM230SA27HGN2R  [QFN50P650X650X128_HS-45N]

### Ports
ZW_RST (in, see ZW Radio[2B]), ZW_RST (in, see ZW Radio[3D]), ZW_RX (in, see ESP32[2B], SerialConverter[2B], ZW Radio[4D]), ZW_RX (out, see ESP32[2B], SerialConverter[2B], ZW Radio[2C]), ZW_SWCLK (bidir, see ZW Radio[4D]), ZW_SWCLK (see ZW Radio[2B]), ZW_SWDIO (bidir, see ZW Radio[3D]), ZW_SWDIO (see ZW Radio[2C]), ZW_SWO (bidir, see ZW Radio[4D]), ZW_SWO (see ZW Radio[2C]), ZW_TX (in, see ESP32[2B], SerialConverter[2B], ZW Radio[2C]), ZW_TX (out, see ESP32[2B], SerialConverter[2B], ZW Radio[3D])

### Nets
GND: C11.1 C12.1 C13.1 P5.2 U6.2(GND) U6.4(GND) U6.27(GND) U6.44(GND) U6.45(GND) U6.46(GND) U6.47(GND) U6.48(GND)
VCC: C12.2 C13.2 P5.1 R20.2 U6.25(VREGVDD) U6.26(IOVDD)
ZW_RST: P5.3 R20.1 U6.1(nRESET) ; port ZW_RST
ZW_RX: P5.4 U6.22(PA09) ; port ZW_RX
ZW_SWCLK: P5.8 U6.13(PA01) ; port ZW_SWCLK
ZW_SWDIO: P5.7 U6.14(PA02) ; port ZW_SWDIO
ZW_SWO: P5.6 U6.15(PA03) ; port ZW_SWO
ZW_TX: P5.5 U6.21(PA08) ; port ZW_TX
NetANT1_1: ANT1.1(RF_Feeding_Point) C11.2 U6.3(RFIO)

Not connected (* = marked no-connect by the designer): ANT1 2(To_trace_element); P5 9* 10*; U6 5(PB06) 6(PB05) 7(PB04) 8(PB03) 9(PB02) 10(PB01) 11(PB00) 12(PA00) 16(PA04) 17(PA05) 18(DECOUPLE) 19(PA06) 20(PA07) 23(PA10) 24(VDCDC) 28(PD05) 29(PD04) 30(PD03) 31(PD02) 32(PD01) 33(PD00) 34(PC00) 35(PC01) 36(PC02) 37(PC03) 38(PC04) 39(PC05) 40(PC06) 41(PC07) 42(PC08) 43(PC09)

### Library data of the parts
ANT1 = CMP-56579-000002-1: RF ANT CHIP SOLDER SMD; Impedance: 50R; Max Frequency: 928MHz; Number of Pins: 2; Mount: Surface Mount; RoHS Compliant: No; Contact Plating: Tin
C11 = CMP-1036-00283-2: Manufacturer: AVX Interconnect / Elco; Part Number: 08055A2R2CAT2A
C12 C13 = CMP-2000-05016-2: as C3 on sheet ESP32; Voltage Rating (DC): 50V; Package Quantity: 4000; Tolerance: 10%; Voltage Rating: 50V; Dielectric: X7R; Case/Package: 0805; Lead Free: Lead Free; Dielectric Material: Ceramic; Thickness: 0.037inch; Weight: 0.001411oz; Max Operating Temperature: 125°C; REACH SVHC: No SVHC; Mount: Surface Mount; RoHS Compliant: Yes; Depth: 1.25mm; Height: 0.5mm; Case Code (Metric): 2012; Length: 2mm; Termination: Standard; Case Code (Imperial): 0805; Number of Pins: 2; Voltage: 50V; Radiation Hardening: No; Min Operating Temperature: -55°C; Capacitance: 100nF; Width: 1.2mm; Series: MLCC X7R; Packaging: Cut Tape
P5 = CMP-1502-01053-1: SMT Vertical Pin Header WR-PHD, Pitch 2.54 mm, Dual Row, 10 pins; Manufacturer: Wurth Elektronik; Gender: Male; Rated Current: 3A; Working Voltage: 250VAC; Withstanding Voltage: 500VAC; Pitch: 2.54mm; Pin Number: 10; Contact Resistance: 20mOhm; Packaging: TapeandReel; Part Number: 61031021121; Mounting Technology: SMT; Package Reference: 61031021121; Operating Temperature: -40to125degC; Manufacturer URL: http://www.we-online.de; Publisher: WurthElektronik; Datasheet URL: https://katalog.we-online.de/em/datasheet/6103xx21121.pdf; Orientation: Vertical; Row Number: Dual
R20 = CMP-07231-003204-1: as R4 on sheet ESP32; Height: 0.5mm; Tolerance: 1%; Max Operating Temperature: 155°C; Thickness: 508um; Radiation Hardening: No; Packaging: Tape and Reel; Depth: 1.25mm; Contact Plating: Tin; Package Quantity: 1; Case Code (Metric): 2012; REACH SVHC: No SVHC; Min Operating Temperature: -55°C; Power Rating: 125mW; Mount: Surface Mount; Length: 2mm; Case Code (Imperial): 0805; Width: 1.25mm; Temperature Coefficient: 100ppm/°C; Termination: SMD/SMT; Composition: Thick Film; Features: Moisture Resistant; Case/Package: 0805; Number of Terminations: 2
U6 = CMP-021-00007-1: ZGM230S Z-wave Sip, Secure Vault; Power: 3.3W; Pins: 48; Case/Package: QFN-44

## Nets that join several sheets
GND: ESP32 (16 pins), SerialConverter (6 pins), Connectors (20 pins), PHY (C10.1 R14.2 U5.25), ZW Radio (12 pins)
VCC: ESP32 (13 pins), SerialConverter (C7.2 P4.2 U4.6 U4.7), Connectors (7 pins), PHY (5 pins), ZW Radio (6 pins)
ERX_N: Connectors (J3.6 R9.1), PHY (U5.22)
ERX_P: Connectors (J3.3 R8.1), PHY (U5.23)
ESP_RX: ESP32 (MD2.34), SerialConverter (U4.26)
ESP_TX: ESP32 (MD2.35), SerialConverter (U4.25)
ETH_CLK: ESP32 (MD2.28), PHY (U5.5)
ETH_CRS_DV: ESP32 (MD2.12), PHY (R18.1)
ETH_MDC: ESP32 (MD2.37), PHY (U5.13)
ETH_MDIO: ESP32 (MD2.30), PHY (U5.12)
ETH_RXD0: ESP32 (MD2.10), PHY (R15.1)
ETH_RXD1: ESP32 (MD2.11), PHY (R16.1)
ETH_TXD0: ESP32 (MD2.31), PHY (U5.17)
ETH_TXD1: ESP32 (MD2.36), PHY (U5.18)
ETH_TXEN: ESP32 (MD2.33), PHY (U5.16)
ETX_N: Connectors (J3.2 R7.1), PHY (U5.20)
ETX_P: Connectors (J3.1 R6.1), PHY (U5.21)
PHY_INT: ESP32 (MD2.8), PHY (R19.2 U5.14)
PHY_L1: Connectors (J3.9), PHY (U5.3)
PHY_L2: Connectors (J3.12), PHY (U5.2)
PHY_RXER: ESP32 (MD2.27), PHY (U5.10)
USB_D_N: SerialConverter (U4.5), Connectors (J2.A7 J2.B7)
USB_D_P: SerialConverter (U4.4), Connectors (J2.A6 J2.B6)
USB_VB: ESP32 (C5.2 J1.1 U2.3), SerialConverter (U3.8 U4.8), Connectors (J2.A4-B9 J2.B4-A9 J4.A4-B9 J4.B4-A9)
USBB_D_N: SerialConverter (U3.4), Connectors (J4.A7 J4.B7)
USBB_D_P: SerialConverter (U3.3), Connectors (J4.A6 J4.B6)
ZB_RX: ESP32 (MD2.13), SerialConverter (U3.21)
ZB_TX: ESP32 (MD2.23), SerialConverter (U3.20)
ZW_RX: ESP32 (MD2.26), SerialConverter (U3.13), ZW Radio (P5.4 U6.22)
ZW_TX: ESP32 (MD2.29), SerialConverter (U3.12), ZW Radio (P5.5 U6.21)